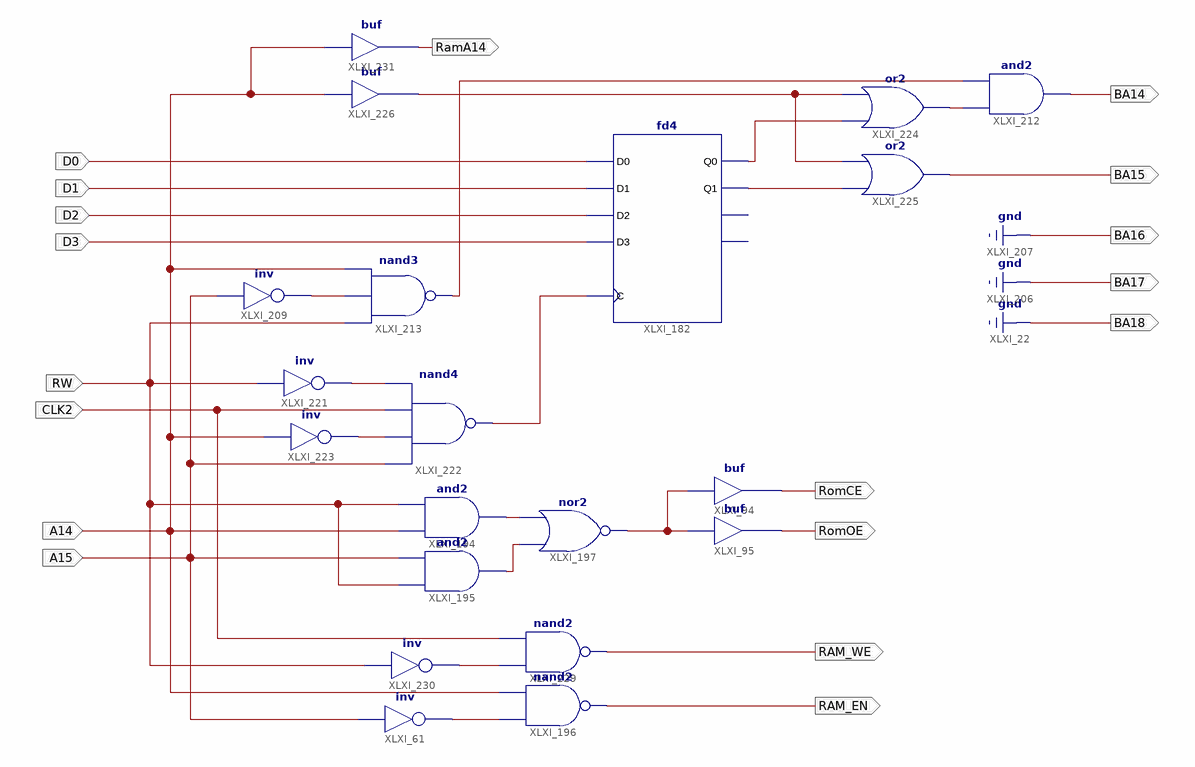
[diagram p0: schematic sheet 1]
// Xilinx ISE schematic A78maxi64k.sch (xc9500xl) as structural Verilog: 20 symbols, 18 ports
module A78maxi64k (
  input  D0,
  input  D1,
  input  D2,
  input  A14,
  input  D3,
  input  CLK2,
  input  RW,
  input  A15,
  output BA18,
  output BA17,
  output BA16,
  output BA14,
  output RomCE,
  output RomOE,
  output RAM_WE,
  output BA15,
  output RAM_EN,
  output RamA14
);

  wire XLXN_114, XLXN_260, XLXN_277, XLXN_285, XLXN_286, XLXN_317, XLXN_335, XLXN_336, XLXN_337, XLXN_340,
       XLXN_346, XLXN_347, XLXN_352, XLXN_369;

  fd4 XLXI_182 (.C(XLXN_337), .D0(D0), .D1(D1), .D2(D2), .D3(D3), .Q0(XLXN_347), .Q1(XLXN_346));  // open: Q2, Q3
  not XLXI_209 (XLXN_317, A15);
  and XLXI_212 (BA14, XLXN_340, XLXN_277);
  nand XLXI_213 (XLXN_277, RW, XLXN_317, A14);
  and XLXI_194 (XLXN_286, A14, RW);
  and XLXI_195 (XLXN_285, RW, A15);
  nor XLXI_197 (XLXN_114, XLXN_285, XLXN_286);
  buf XLXI_95 (RomOE, XLXN_114);
  buf XLXI_94 (RomCE, XLXN_114);
  not XLXI_221 (XLXN_335, RW);
  nand XLXI_222 (XLXN_337, A15, XLXN_336, CLK2, XLXN_335);
  not XLXI_223 (XLXN_336, A14);
  or XLXI_224 (XLXN_340, XLXN_347, XLXN_352);
  or XLXI_225 (BA15, XLXN_346, XLXN_352);
  buf XLXI_226 (XLXN_352, A14);
  not XLXI_61 (XLXN_260, A15);
  nand XLXI_196 (RAM_EN, XLXN_260, A14);
  nand XLXI_229 (RAM_WE, XLXN_369, CLK2);
  not XLXI_230 (XLXN_369, RW);
  buf XLXI_231 (RamA14, A14);

  assign BA16 = 1'b0;
  assign BA17 = 1'b0;
  assign BA18 = 1'b0;

  // Notes on the sheet:
  //   LOC on signal D0 = 23
  //   LOC on signal D1 = 22
  //   LOC on signal D2 = 21
  //   LOC on signal BA18 = 39
  //   LOC on signal A14 = 37
  //   LOC on signal D3 = 20
  //   LOC on signal CLK2 = 44
  //   LOC on signal RW = 43
  //   LOC on signal BA17 = 41
  //   LOC on signal BA16 = 38
  //   LOC on signal BA14 = 42
  //   LOC on signal A15 = 36
  //   LOC on signal RomCE = 8
  //   LOC on signal RomOE = 18
  //   LOC on signal RAM_WE = 40
  //   LOC on signal BA15 = 33
  //   LOC on signal RAM_EN = 7
  //   LOC on signal RamA14 = 6
endmodule
